# EAGLE design lm3410-sepic-led-driver-test-pcb (EAGLE 6.4)
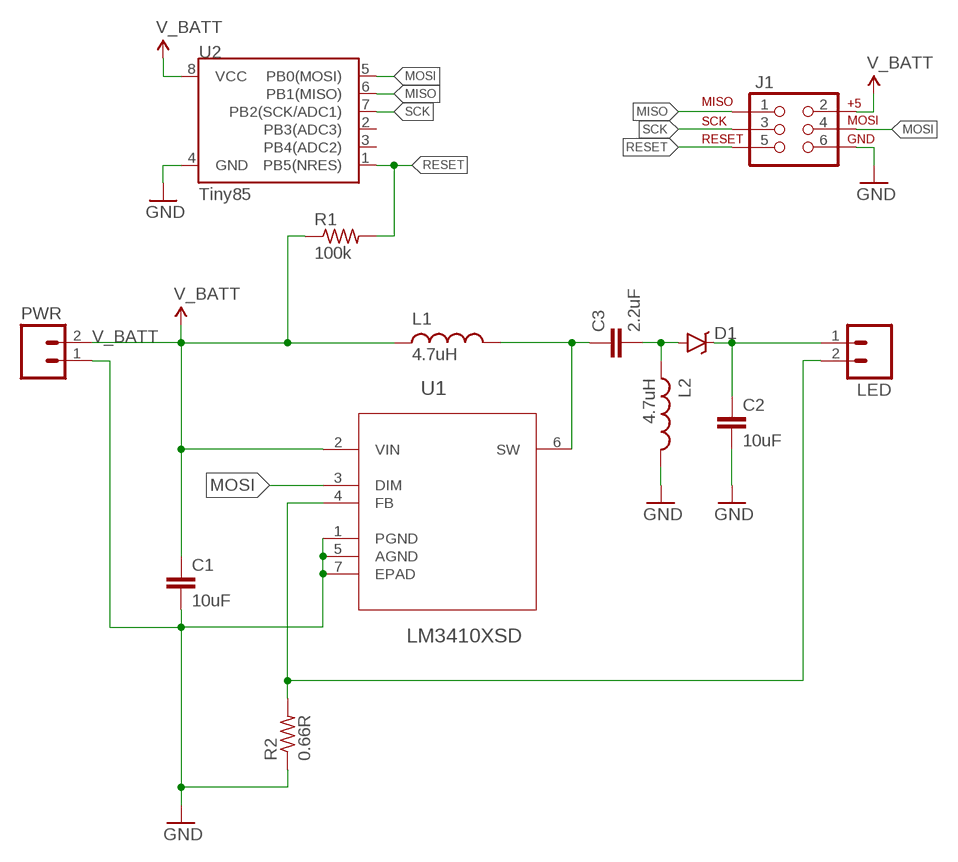
[diagram p0: schematic, sheet 1]

## Parts
C1  10uF  CAPACITOR-CERAMICC0805  [C0805]
C2  10uF  CAPACITOR-CERAMICC0805  [C0805]
C3  2.2uF  CAPACITOR-CERAMICC0805  [C0805]
D1  BAT20J  DIODE-SCHOTTKYBAT20J  [SOD-323]
J1  AVR_SPI_PRG_6PTH  [2X3]
L1  4.7uH  INDUCTORIFSC-0806  [INDUCTOR_2X1.6MM]
L2  4.7uH  INDUCTORIFSC-0806  [INDUCTOR_2X1.6MM]
LED  M02PTH  [1X02]
PWR  M02PTH  [1X02]
R1  100k  RESISTORR0603  [R0603]
R2  0.66R  RESISTORR1206  [R1206]
U1  LM3410XSD  [DFN300X300X80-7N]
U2  Tiny85  ATTINY45TINY85-20-SMT  [SO08-EIAJ]

## Nets
GND: C1.2 C2.2 J1.6 L2.P$2 PWR.1 R2.1 U1.1(PGND) U1.5(AGND) U1.7(EPAD) U2.4(GND)
LED_ANODE: C2.1 D1.C LED.1
MISO: J1.1 U2.6(PB1(MISO))
MOSI: J1.4 U1.3(DIM) U2.5(PB0(MOSI))
N$1: C3.2 D1.A L2.P$1
N$6: LED.2 R2.2 U1.4(FB)
RESET: J1.5 R1.2 U2.1(PB5(NRES))
SCK: J1.3 U2.7(PB2(SCK/ADC1))
SW: C3.1 L1.P$2 U1.6(SW)
V_BATT: C1.1 J1.2 L1.P$1 PWR.2 R1.1 U1.2(VIN) U2.8(VCC)
Unconnected: U2.2(PB3(ADC3)) U2.3(PB4(ADC2))

## Library data of the parts
C1-C3 = A_butts:CAPACITOR-CERAMIC: CAPACITOR, European symbol
D1 = A_butts:DIODE-SCHOTTKY: Schottky diodes in SFE's production catalog BAT20J 1A 23V 0.62Vf RB751 120mA 40V 0.37Vf PMEG4005EJ 0.5A 40V 0.42Vf MBRA140 1A 40V 0.5Vf B340A 3A 40V SMA; PROD_ID: DIO-11623
J1 = A_butts:AVR_SPI_PRG_6: AVR ISP 6 Pin This is the reduced ISP connector for AVR programming. Common on Arduino. This footprint will take up less PCB space and can be used with a 10-pin to 6-pin adapter such as SKU: BOB-08508 **Special note about "TEST_POINT" package. The stop mask is on the top side, so if you want your programming test points to be on the bottom of your board, make sure to place this package on the bottom side of the board. This also ensure that the orientation to program from the bottom side will be correct.
L1 L2 = A_butts:INDUCTOR: Inductors Basic Inductor/Choke - 0603 and 1206. Footprints are not proven and vary greatly between part numbers. SRN6045- 33uH, 20% 1.4A SDR0403-560KL - 56uH, 10%, 500mA RMS/740mA peak
LED PWR = A_butts:M02: Standard 2-pin 0.1" header. Use with - straight break away headers ( PRT-00116) - right angle break away headers (PRT-00553) - swiss pins (PRT-00743) - machine pins (PRT-00117) - female headers (PRT-00115) Molex polarized connector foot print use with: PRT-08233 with associated crimp pins and housings. 2.54_SCREWTERM for use with PRT-10571. 3.5mm Screw Terminal footprints for PRT-08084 5mm Screw Terminal footprints for use with PRT-08433
R1 R2 = A_butts:RESISTOR: RESISTOR, American symbol
U1 = A_butts:LM3410XSD: Constant Current Boost and SEPIC LED Driver; MPN: LM3410XSD; OC_FARNELL: -; OC_NEWARK: 11N9218; PACKAGE: DFN-6; SUPPLIER: National Semiconductor
U2 = A_butts:ATTINY45: Atmel 8-pin 2/4/8kB flash uC; PROD_ID: IC-09092; VALUE: Tiny85-20-SMT

## Board
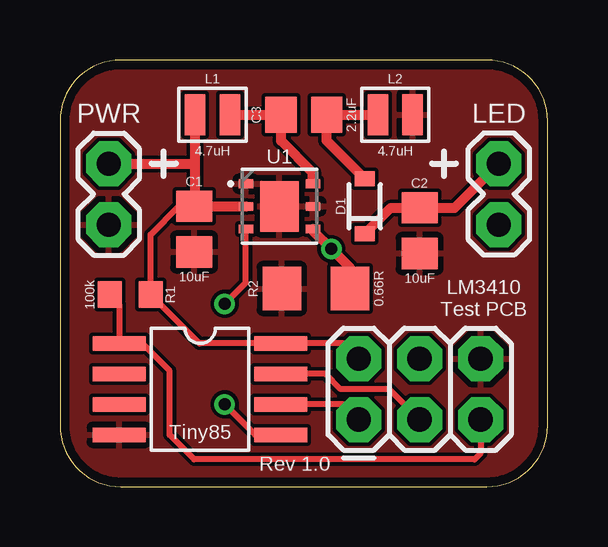
[diagram p1: board, top side]
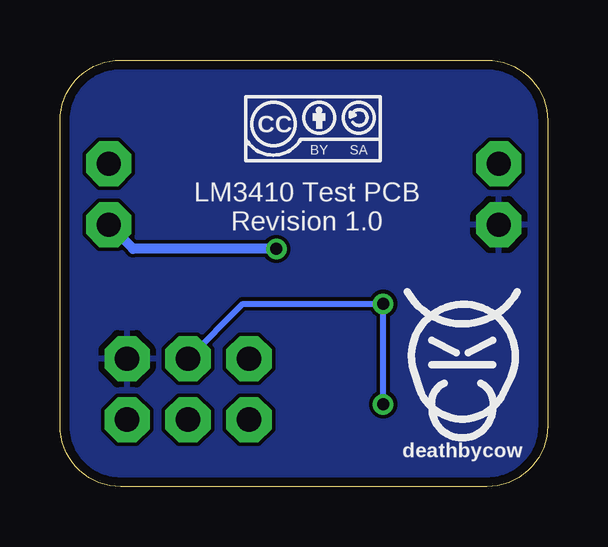
[diagram p2: board, bottom side, seen from below]

Size 20.32 x 17.78 mm. Coordinates in mm from the lower left corner, seen from the top.
Outline: 0,15.24 0,2.54 arc90 2.54,0 17.78,0 arc90 20.32,2.54 20.32,15.24 arc90 17.78,17.78 2.54,17.78 arc90 0,15.24
Copper layers (1*16): Top 0.0356mm / dielectric 1.5011mm / Bottom 0.0356mm
Design rules "LaenPCBOrder2": minimum track width 6mil, minimum drill 13mil, track to track 6mil, track to pad 6mil, pad to pad 6mil, via to via 6mil, smd to smd 6mil, copper to edge 15mil, drill to drill 6mil, minimum pad ring 7mil, minimum via ring 7mil, stop-mask expansion 3mil, vias tented up to drill 20mil, thermal gap 10mil

### Footprints (pad centres in the part's own frame; a part is rotated, then mirrored left to right if it is on the bottom)
C0805 = smd 1.3 x 1.5: 1 -0.95,0; 2 0.95,0
SOD-323 = smd 0.63 x 0.83: A 1.15,0; C -1.15,0
2X3 = drill 1.016 pad 1.88 octagon: 1 0,0; 2 0,2.54; 3 2.54,0; 4 2.54,2.54; 5 5.08,0; 6 5.08,2.54
INDUCTOR_2X1.6MM = smd 0.85 x 1.7: P$1 -0.725,0; P$2 0.725,0
1X02 = drill 1 pad 1.88 octagon: 1 0,0; 2 2.54,0
R0603 = smd 1 x 1.1: 1 -0.85,0; 2 0.85,0
R1206 = smd 1.6 x 1.803: 1 -1.422,0; 2 1.422,0
DFN300X300X80-7N = smd 0.61 x 0.356: 1 -1.397,0.94; 2 -1.397,0; 3 -1.397,-0.94; 4 1.397,-0.94; 5 1.397,0; 6 1.397,0.94 | smd 1.6 x 2.108: 7 0,0
SO08-EIAJ = smd 0.61 x 2.21: 1 -1.905,-3.378; 2 -0.635,-3.378; 3 0.635,-3.378; 4 1.905,-3.378; 5 1.905,3.353; 6 0.635,3.353; 7 -0.635,3.353; 8 -1.905,3.353

### Placement (x,y rotation side)
C1  5.59,10.73 270 top
C2  14.99,10.67 270 top
C3  10.16,15.49 0 top
D1  12.7,11.68 90 top
J1  12.45,2.79 0 top
L1  6.35,15.49 0 top
L2  13.97,15.49 0 top
LED  18.29,13.46 270 top
PWR  2.03,10.92 90 top
R1  2.92,8 180 top
R2  10.67,8.26 0 top
U1  9.14,11.68 0 top
U2  5.84,4.06 270 top
U$1  [COW_SMALL]  3.56,5.59 0 bottom
U$2  [CC-BY-SA-4.0-NO-URL]  11.43,15.11 0 bottom

### Tracks (layer width: path | path; a pad name or v marks a point on that pad's centre or on a via)
GND
  pour Top: 17.78,0 2.54,0 arc-90 0,2.54 0,15.24 arc-90 2.54,17.78 17.78,17.78 arc-90 20.32,15.24 20.32,2.54 arc-90
  pour Bottom: 17.78,0 2.54,0 arc-90 0,2.54 0,15.24 arc-90 2.54,17.78 17.78,17.78 arc-90 20.32,15.24 20.32,2.54 arc-90
LED_ANODE
  Top 0.406: D1.C 13.78,11.62 C2.1 16.44,11.62 LED.1
MISO
  Top 0.254: J1.1 11.81,3.43 U2.6
MOSI  (via drill 0.5)
  Top 0.254: U2.5 8.13,2.16 v6.86,3.43 | v6.86,7.62 7.75,8.51 U1.3
  Bottom 0.254: v6.86,3.43 v6.86,7.62 12.7,7.62 J1.4
N$1
  Top 0.406: L2.P$1 C3.2 11.11,14.42 D1.A
N$6  (via drill 0.5)
  Top 0.406: U1.4 10.54,10.67 v11.3,9.91 12.09,9.12 R2.2
  Bottom 0.406: v11.3,9.91 17.27,9.91 LED.2
RESET
  Top 0.254: R1.2 2.46,7.61 U2.1 3.43,5.97 4.57,4.83 4.57,2.16 5.59,1.14 17.27,1.14 17.53,1.4 J1.5
SCK
  Top 0.254: J1.3 13.72,4.06 11.68,4.06 11.05,4.7 U2.7
SW
  Top 0.406: L1.P$2 C3.1 9.21,14.41 10.54,13.08 U1.6
V_BATT
  Top 0.254: C1.1 4.95,11.68 3.77,10.5 R1.1 5.8,5.97 U2.8 11.81,5.97 J1.2
  Top 0.406: 5.62,11.72 5.62,13.59 | 5.62,13.59 L1.P$1 | C1.1 U1.2 | PWR.2 5.5,13.46 5.62,13.59
  Top 0.61: 5.62,11.72 C1.1

### Text on the board
tPlace: LM3410 / Test PCB | Rev 1.0
bPlace: LM3410 Test PCB / Revision 1.0